# EAGLE design SC-STAGE (EAGLE 9.4.0)
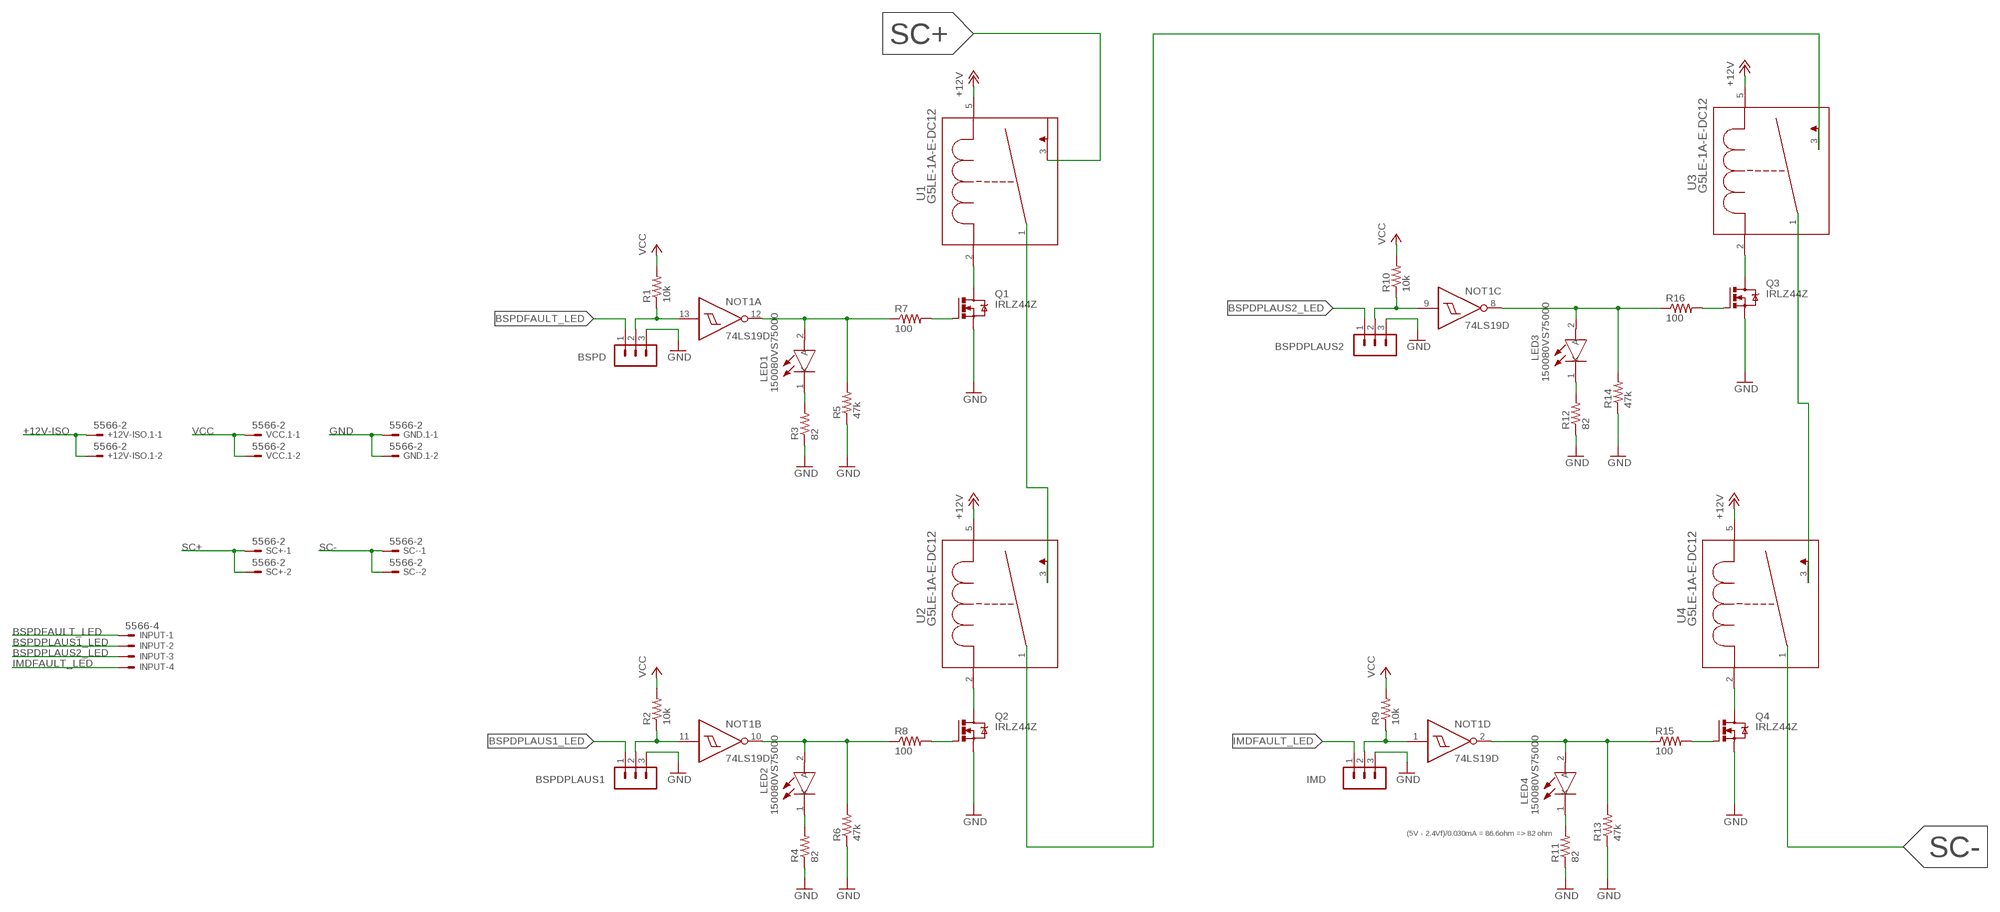
[diagram p0: schematic, sheet 1]

## Parts
+12V-ISO.1  5566-2  [5566-2]
BSPD  MA03-1  [MA03-1]
BSPDPLAUS1  MA03-1  [MA03-1]
BSPDPLAUS2  MA03-1  [MA03-1]
GND.1  5566-2  [5566-2]
IMD  MA03-1  [MA03-1]
INPUT  5566-4  [5566-4]
LED1  150080VS75000  [LEDC2012X80N]
LED2  150080VS75000  [LEDC2012X80N]
LED3  150080VS75000  [LEDC2012X80N]
LED4  150080VS75000  [LEDC2012X80N]
NOT1  74LS19D  [SO14]
Q1  IRLZ44Z  [TO220BH]
Q2  IRLZ44Z  [TO220BH]
Q3  IRLZ44Z  [TO220BH]
Q4  IRLZ44Z  [TO220BH]
R1  10k  R-US_R0805  [R0805]
R2  10k  R-US_R0805  [R0805]
R3  82  R-US_R0805  [R0805]
R4  82  R-US_R0805  [R0805]
R5  47k  R-US_R0805  [R0805]
R6  47k  R-US_R0805  [R0805]
R7  100  R-US_R0805  [R0805]
R8  100  R-US_R0805  [R0805]
R9  10k  R-US_R0805  [R0805]
R10  10k  R-US_R0805  [R0805]
R11  82  R-US_R0805  [R0805]
R12  82  R-US_R0805  [R0805]
R13  47k  R-US_R0805  [R0805]
R14  47k  R-US_R0805  [R0805]
R15  100  R-US_R0805  [R0805]
R16  100  R-US_R0805  [R0805]
SC+  5566-2  [5566-2]
SC-  5566-2  [5566-2]
U1  G5LE-1A-E-DC12  [G5LE-1A-E-DC12]
U2  G5LE-1A-E-DC12  [G5LE-1A-E-DC12]
U3  G5LE-1A-E-DC12  [G5LE-1A-E-DC12]
U4  G5LE-1A-E-DC12  [G5LE-1A-E-DC12]
VCC.1  5566-2  [5566-2]

## Nets
+12V-ISO: +12V-ISO.1.1 +12V-ISO.1.2 U1.5 U2.5 U3.5 U4.5 ; supply symbol labelled +12V
BSPDFAULT_LED: BSPD.1 INPUT.1
BSPDPLAUS1_LED: BSPDPLAUS1.1 INPUT.2
BSPDPLAUS2_LED: BSPDPLAUS2.1 INPUT.3
GND: BSPD.3 BSPDPLAUS1.3 BSPDPLAUS2.3 GND.1.1 GND.1.2 IMD.3 Q1.S Q2.S Q3.S Q4.S R3.1 R4.1 R5.1 R6.1 R11.1 R12.1 R13.1 R14.1
IMDFAULT_LED: IMD.1 INPUT.4
LED4: LED4.1(K) R11.2
N$1: Q1.G R7.2
N$2: LED1.2(A) NOT1.12(A:O) R5.2 R7.1
N$3: LED1.1(K) R3.2
N$4: Q1.D U1.2
N$5: Q2.G R8.2
N$6: LED2.2(A) NOT1.10(B:O) R6.2 R8.1
N$7: LED2.1(K) R4.2
N$8: Q2.D U2.2
N$9: U1.1 U2.3
N$10: U3.1 U4.3
N$14: Q4.G R15.2
N$15: LED4.2(A) NOT1.2(D:O) R13.2 R15.1
N$17: Q4.D U4.2
N$18: Q3.G R16.2
N$19: LED3.2(A) NOT1.8(C:O) R14.2 R16.1
N$20: LED3.1(K) R12.2
N$21: Q3.D U3.2
N$38: U2.1 U3.3
N$626: BSPDPLAUS2.2 NOT1.9(C:I) R10.1
N$9581: IMD.2 NOT1.1(D:I) R9.1
N$11552: BSPDPLAUS1.2 NOT1.11(B:I) R2.1
N$105105: BSPD.2 NOT1.13(A:I) R1.1
SC+: SC+.1 SC+.2 U1.3
SC-: SC-.1 SC-.2 U4.1
VCC: R1.2 R2.2 R9.2 R10.2 VCC.1.1 VCC.1.2
Unconnected: NOT1.3(E:I) NOT1.4(E:O) NOT1.5(F:I) NOT1.6(F:O)

## Notes on the sheet
- (5V - 2.4Vf)/0.030mA = 86.6ohm => 82 ohm

## Power pins joined to a net without a drawn wire
GND: NOT1.7(P:GND)
VCC: NOT1.14(P:VCC)

## Library data of the parts
+12V-ISO.1 GND.1 SC+ SC- VCC.1 = con-molex:5566-2: Mini FIT connector 2 pol Source: http://www.molex.com; MF: MOLEX; OC_FARNELL: 1822072; OC_NEWARK: unknown
BSPD BSPDPLAUS1 BSPDPLAUS2 IMD = con-lstb:MA03-1: PIN HEADER; OC_FARNELL: unknown; OC_NEWARK: unknown
INPUT = con-molex:5566-4: Mini FIT connector 4 pol Source: http://www.molex.com; MF: MOLEX; OC_FARNELL: unknown; OC_NEWARK: unknown
LED1-LED4 = 150080VS75000:150080VS75000: Wurth Elektronik WL-SMCW 570 nm Green LED, 2012 (0805) Clear SMD package Source: Datasheet <https://componentsearchengine.com/Datasheets/1/150080VS75000.pdf>; DESCRIPTION: Wurth Elektronik WL-SMCW 570 nm Green LED, 2012 (0805) Clear SMD package; HEIGHT: 0.8mm; MANUFACTURER_NAME: Wurth Elektronik; MANUFACTURER_PART_NUMBER: 150080VS75000; MOUSER_PART_NUMBER: 710-150080VS75000; MOUSER_PRICE-STOCK: https://www.mouser.com/Search/Refine.aspx?Keyword=710-150080VS75000
NOT1 = 74xx-us:74*19: Hex schmitt trigger INVERTER
Q1-Q4 = transistor-power:IRLZ44Z: N-Channel HEXFET® Power MOSFET Logic Level AUTOMOTIVE MOSFET Source: http://www.irf.com/product-info/datasheets/data/irlz44zpbf.pdf
R1-R16 = rcl:R-US_: RESISTOR, American symbol; SPICEPREFIX: R
U1-U4 = IowaFormula:G5LE-1A-E-DC12; MANUFACTURER_PART_NUMBER: G5LE1A4 DC5; VENDOR: OMRON

## Board
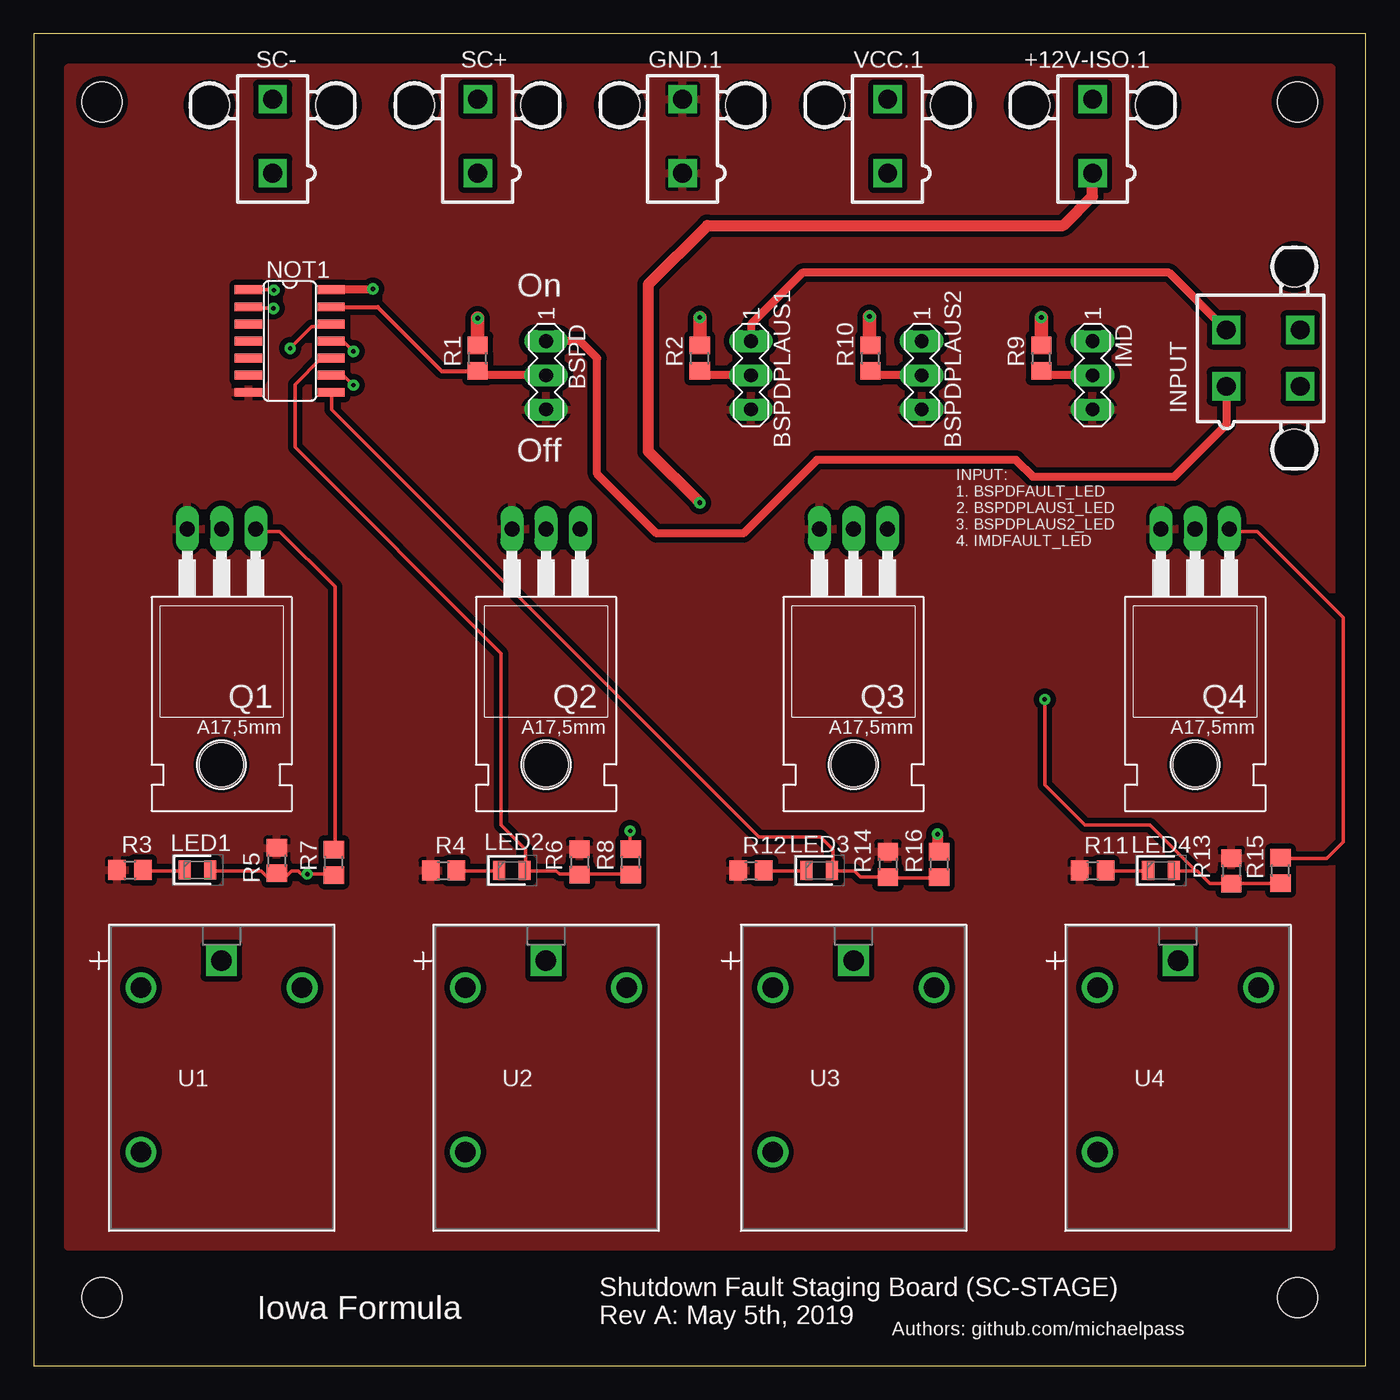
[diagram p1: board, top side]
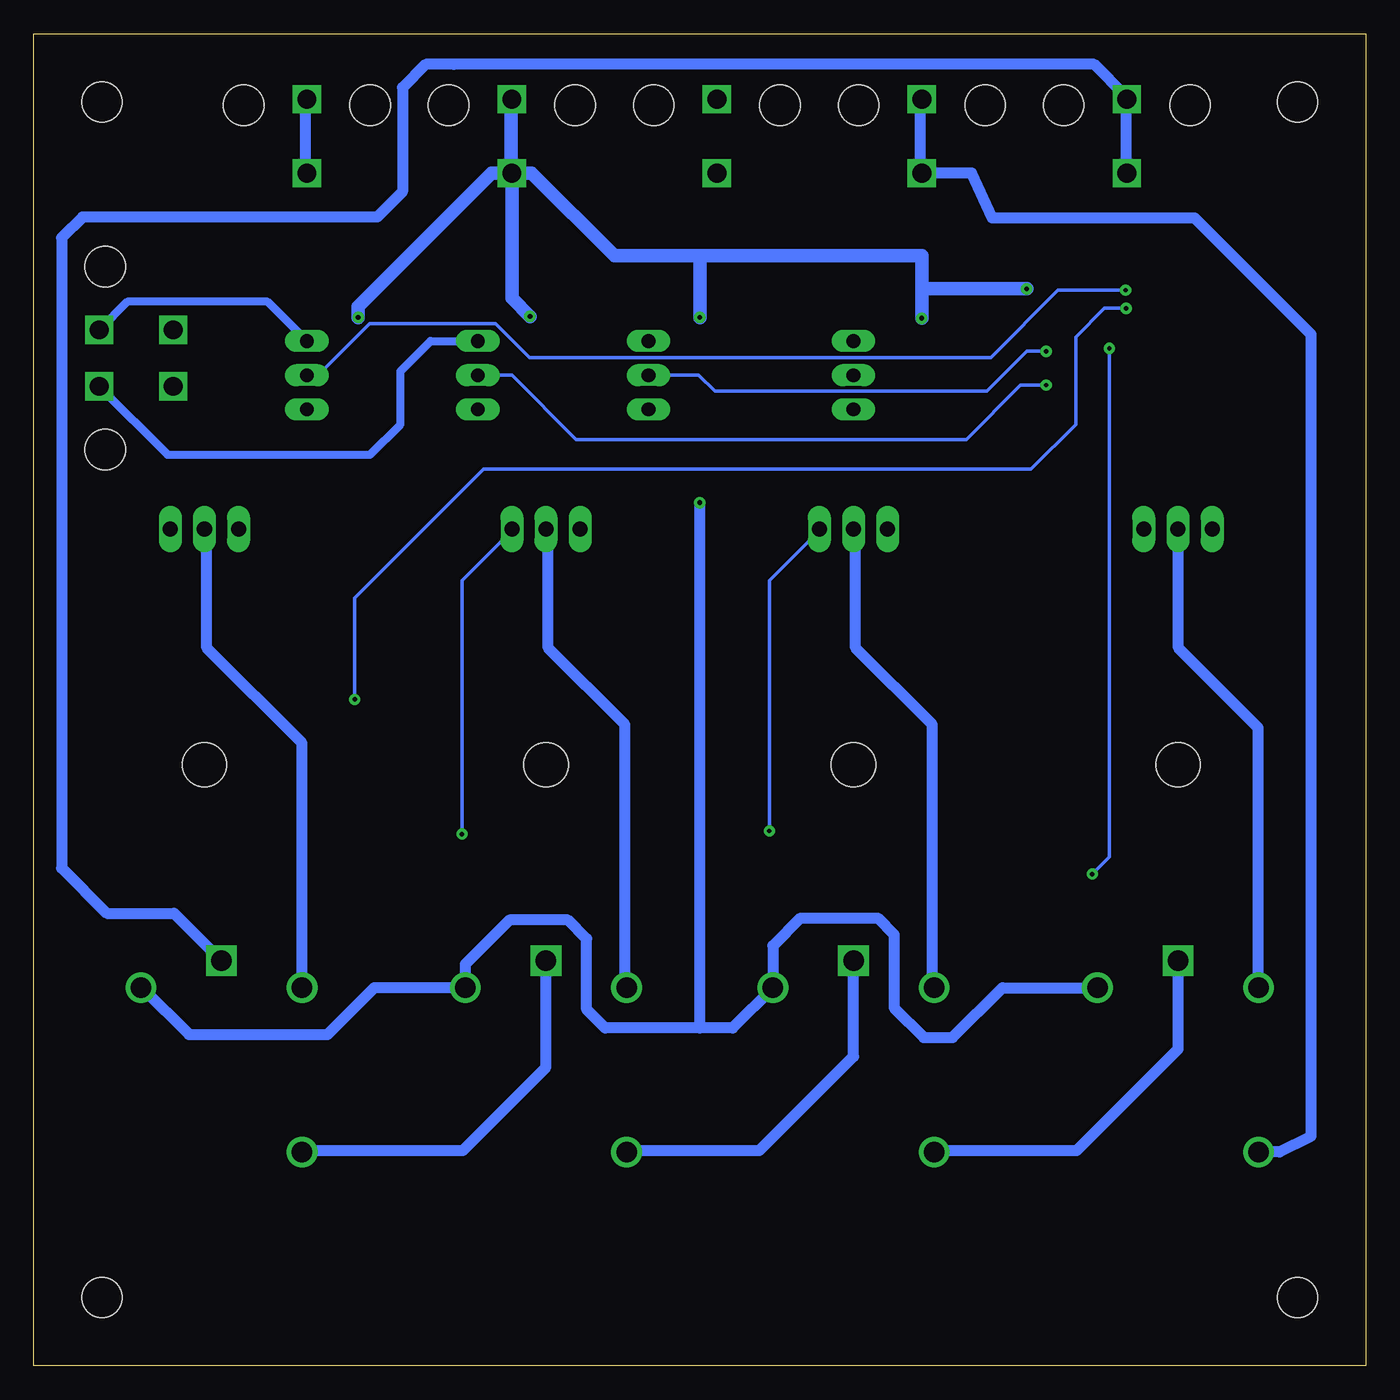
[diagram p2: board, bottom side, seen from below]

Size 99.06 x 99.06 mm. Coordinates in mm from the lower left corner, seen from the top.
Outline: 0,0 99.06,0 99.06,99.06 0,99.06 0,0
Copper layers (1*16): Top 0.035mm / dielectric 1.5mm / Bottom 0.035mm
Design rules "default *": minimum track width 10mil, minimum drill 13mil, track to track 8mil, track to pad 8mil, pad to pad 8mil, via to via 8mil, smd to smd 8mil, copper to edge 10mil, drill to drill 8mil, minimum pad ring 12mil, minimum via ring 10mil, stop-mask expansion 4mil, vias tented up to drill 25mil, thermal gap 10mil
Holes 3 mm at 93.98,93.98 5.08,93.98 5.08,5.08 93.98,5.08

### Footprints (pad centres in the part's own frame; a part is rotated, then mirrored left to right if it is on the bottom)
5566-2 = drill 1.4 square: 1 0,-2.75; 2 0,2.75 | hole 3: 4.7,2.29; -4.7,2.29
MA03-1 = drill 1.016 long: 1 -2.54,0; 2 0,0; 3 2.54,0
5566-4 = drill 1.4 square: 1 2.1,-2.75; 2 -2.1,-2.75; 3 2.1,2.75; 4 -2.1,2.75 | hole 3: 6.8,2.29; -6.8,2.29
LEDC2012X80N = smd 0.9 x 1.4: 1 -0.95,0; 2 0.95,0
SO14 = smd 0.66 x 2.032: 1 -3.81,-3.073; 2 -2.54,-3.073; 3 -1.27,-3.073; 4 0,-3.073; 5 1.27,-3.073; 6 2.54,-3.073; 7 3.81,-3.073; 8 3.81,3.073; 9 2.54,3.073; 10 1.27,3.073; 11 0,3.073; 12 -1.27,3.073; 13 -2.54,3.073; 14 -3.81,3.073
TO220BH = drill 1.118 long: D 0,-6.35; G -2.54,-6.35; S 2.54,-6.35 | hole 3.302: 0,11.176
R0805 = smd 1.3 x 1.5: 1 -0.95,0; 2 0.95,0
G5LE-1A-E-DC12 = drill 1.524 pad 2.032 square: 1 0,17.424 | drill 1.524 pad 2.032: 2 -5.994,15.418; 3 -5.994,3.2; 5 5.994,15.418

### Placement (x,y rotation side)
+12V-ISO.1  78.74,91.44 0 top
BSPD  38.1,73.66 270 top
BSPDPLAUS1  53.34,73.66 270 top
BSPDPLAUS2  66.04,73.66 270 top
GND.1  48.26,91.44 0 top
IMD  78.74,73.66 270 top
INPUT  91.44,74.93 270 top
LED1  12.19,36.88 0 top
LED2  35.56,36.83 0 top
LED3  58.42,36.83 0 top
LED4  83.82,36.83 0 top
NOT1  19.05,76.2 270 top
Q1  13.97,55.88 180 top
Q2  38.1,55.88 180 top
Q3  60.96,55.88 180 top
Q4  86.36,55.88 180 top
R1  33.02,74.93 90 top
R2  49.53,74.93 90 top
R3  7.16,36.88 0 top
R4  30.48,36.83 0 top
R5  18.08,37.57 270 top
R6  40.59,37.47 270 top
R7  22.33,37.44 90 top
R8  44.4,37.47 90 top
R9  74.93,74.93 90 top
R10  62.23,74.93 90 top
R11  78.74,36.83 0 top
R12  53.34,36.83 0 top
R13  89.05,36.8 270 top
R14  63.53,37.29 270 top
R15  92.71,36.83 90 top
R16  67.34,37.29 90 top
SC+  33.02,91.44 0 top
SC-  17.78,91.44 0 top
U1  13.97,12.7 0 top
U2  38.1,12.7 0 top
U3  60.96,12.7 0 top
U4  85.09,12.7 0 top
VCC.1  63.5,91.44 0 top

### Tracks (layer width: path | path; a pad name or v marks a point on that pad's centre or on a via)
+12V-ISO  (via drill 0.35)
  Top 0.813: v49.53,64.19 45.72,68 45.72,80.42 50.09,84.78 76.56,84.78 78.74,86.96 +12V-ISO.1.1
  Bottom 0.254: 78.87,88.7 +12V-ISO.1.1 | 78.87,94.18 +12V-ISO.1.2 | 90.98,28.12 U4.5
  Bottom 0.813: 78.87,94.18 78.87,88.7 | U1.5 27.03,28.12 30.73,24.41 32.87,24.41 35.08,26.62 35.08,32.08 36.3,33.3 42.04,33.3 44.09,31.24 U2.5 47.09,25.12 49.53,25.12 | 49.53,25.12 56.57,25.12 57.94,26.49 57.94,31.75 59.33,33.15 63.68,33.15 66.95,29.87 U3.5 73.74,28.12 77.22,24.64 87.5,24.64 90.98,28.12 | 49.53,25.12 v49.53,64.19
BSPDFAULT_LED
  Top 0.61: INPUT.1 88.69,72.39 88.69,70 84.8,66.12 74.3,66.12 73.05,67.36 58.24,67.36 52.78,61.9 46.33,61.9 41.91,66.32 41.91,74.93 40.64,76.2 BSPD.1
BSPDPLAUS1_LED
  Top 0.61: INPUT.2 84.44,81.28 57.15,81.28 53.34,77.47 BSPDPLAUS1.1
BSPDPLAUS2_LED
  Bottom 0.61: INPUT.3 89.1,67.74 74.04,67.74 71.78,70 71.78,73.97 69.55,76.2 BSPDPLAUS2.1
GND
  pour Top (isolate 0.406): 3.81,8.89 96.52,8.89 96.52,96.52 2.54,96.52 2.54,8.89
IMDFAULT_LED
  Bottom 0.61: IMD.1 81.66,79.12 92.1,79.12 INPUT.4
LED4
  Top 0.254: LED4.1 82.75,36.8 79.78,36.8 R11.2
N$1
  Top 0.254: R7.2 22.4,38.41 22.4,57.94 18.29,62.05 16.69,62.05 Q1.G
N$2  (via drill 0.33)
  Top 0.254: LED1.2 13.26,36.8 16.92,36.8 17.37,36.35 17.83,36.35 18.06,36.58 R5.2 18.29,36.58 18.52,36.35 18.75,36.35 19.2,36.8 19.66,36.8 19.89,36.58 v20.34,36.58 22.17,36.58 R7.1 | v19.07,75.67 20.68,77.27 21.95,77.27 NOT1.12
  Bottom 0.254: v19.07,75.67 19.07,37.85 v20.34,36.58
N$3
  Top 0.254: LED1.1 11.2,36.8 8.23,36.8 R3.2
N$4
  Bottom 0.254: 13.95,62.05 Q1.D | 8,28.12 U1.2
  Bottom 0.813: 13.95,62.05 13.95,53.39 8,47.45 8,28.12
N$5  (via drill 0.33)
  Top 0.254: v44.35,39.78 44.35,38.63 R8.2
  Bottom 0.254: v44.35,39.78 44.35,58.4 40.69,62.05 Q2.G
N$6
  Top 0.254: R8.1 44.35,36.58 40.69,36.58 R6.2 40.46,36.58 39.09,36.58 38.86,36.8 36.58,36.8 LED2.2 36.58,37.03 36.58,38.41 34.75,40.23 34.75,52.98 19.43,68.3 19.43,72.97 21.39,74.93 NOT1.10
N$7
  Top 0.254: LED2.1 34.52,36.8 31.55,36.8 R4.2
N$8
  Bottom 0.254: 37.95,62.05 Q2.D | 32.23,28.12 U2.2
  Bottom 0.813: 37.95,62.05 37.95,53.39 32.23,47.68 32.23,28.12
N$9
  Bottom 0.254: 32,16 U2.3
  Bottom 0.813: 32,16 21.51,16 13.97,23.55 U1.1
N$10
  Bottom 0.254: 79.1,16 U4.3
  Bottom 0.813: 79.1,16 67.16,16 60.96,22.2 U3.1
N$14
  Top 0.254: R15.2 92.81,37.72 96.14,37.72 97.38,38.96 97.38,55.65 90.98,62.05 88.92,62.05 Q4.G
N$15  (via drill 0.33)
  Top 0.254: 86.41,36.8 86.54,36.8 87.45,35.89 88.92,35.89 R13.2 89.15,35.89 92.58,35.89 R15.1 | 86.41,36.8 84.81,36.8 LED4.2 | v17.83,78.64 16,78.64 NOT1.2 | 86.41,36.8 82.98,40.23 78.16,40.23 75.18,43.2 v75.18,49.55
  Bottom 0.254: v17.83,78.64 19.43,78.64 21.57,76.5 21.57,70 24.89,66.67 65.61,66.67 75.18,57.1 v75.18,49.55
N$17
  Bottom 0.254: 86.18,62.05 Q4.D
  Bottom 0.813: 86.18,62.05 86.18,53.39 79.1,46.3 U4.2
N$18  (via drill 0.33)
  Top 0.254: 67.21,38.41 R16.2
  Top 0.813: v67.21,39.55 67.21,38.41
  Bottom 0.254: v67.21,39.55 67.21,58.4 63.55,62.05 Q3.G
N$19
  Top 0.254: R16.1 67.27,36.27 63.65,36.27 63.56,36.36 63.55,36.35 R14.2 63.32,36.35 61.49,36.35 61.04,36.8 59.44,36.8 LED3.2 59.44,37.03 59.44,38.41 58.52,39.32 53.95,39.32 22.17,71.09 22.17,72.24 NOT1.8
N$20
  Top 0.254: LED3.1 57.38,36.8 54.41,36.8 R12.2
N$21
  Bottom 0.254: 60.81,62.05 Q3.D | 55.09,28.12 U3.2
  Bottom 0.813: 60.81,62.05 60.81,53.39 55.09,47.68 55.09,28.12
N$38
  Bottom 0.254: 54.86,16 U3.3
  Bottom 0.813: 54.86,16 45.11,16 38.1,23.01 U2.1
N$626  (via drill 0.33)
  Top 0.254: v23.77,72.92 23.09,73.61 22.17,73.61 NOT1.9
  Top 0.61: BSPDPLAUS2.2 62.55,73.66 R10.1
  Bottom 0.254: v23.77,72.92 25.68,72.92 29.72,68.89 58.73,68.89 63.5,73.66 BSPDPLAUS2.2
N$9581  (via drill 0.33)
  Top 0.254: NOT1.1 17.83,80.01 v17.86,79.98
  Top 0.61: IMD.2 75.25,73.66 R9.1
  Bottom 0.254: v17.86,79.98 22.89,79.98 27.89,74.98 62.18,74.98 64.69,77.5 74.07,77.5 77.72,73.84 78.64,73.84 IMD.2
N$11552  (via drill 0.33)
  Top 0.254: v23.77,75.44 23.09,76.12 22.17,76.12 NOT1.11
  Top 0.61: BSPDPLAUS1.2 49.85,73.66 R2.1
  Bottom 0.254: v23.77,75.44 25.2,75.44 28.17,72.47 48.41,72.47 49.61,73.66 BSPDPLAUS1.2
N$105105
  Top 0.305: NOT1.13 25.58,78.74 30.35,73.97 33.01,73.97 R1.1
  Top 0.61: BSPD.2 33.34,73.66 R1.1
SC+
  Bottom 0.254: 33.15,88.7 SC+.1 | 33.15,94.18 SC+.2
  Bottom 0.813: 33.15,94.18 33.15,88.7 | U1.3 6.43,15.9 4.09,17.07 4.09,76.71 12.75,85.37 27.8,85.37 29.32,88.69 SC+.1
SC-
  Bottom 0.254: 17.83,88.7 SC-.1 | 17.83,94.18 SC-.2 17.83,94.41
  Bottom 0.813: 17.83,94.18 17.83,88.7 | U4.1 88.62,33.66 93.62,33.66 96.98,37.01 96.98,83.87 95.43,85.42 79.17,85.42 73.51,85.42 71.63,87.3 71.63,95.05 69.9,96.77 67.82,96.77 20.19,96.77 17.83,94.41
VCC  (via drill 0.35)
  Top 0.61: v25.22,80.09 25.17,80.03 22.15,80.03 NOT1.14
  Top 1.016: v74.93,77.95 R9.2 | v33.02,77.9 R1.2 | v49.53,77.95 R2.2 | v62.15,78.03 62.15,75.96 R10.2
  Bottom 0.254: 63.55,94.18 VCC.1.2 | 63.55,89.15 VCC.1.1
  Bottom 1.016: VCC.1.1 62.02,88.69 55.88,82.55 49.53,82.55 | 49.53,82.55 33.02,82.55 33.02,80.09 | VCC.1.1 65,88.69 74.93,78.76 v74.93,77.95 | 33.02,80.09 v33.02,77.9 | 49.53,82.55 v49.53,77.95 | VCC.1.1 63.5,79.38 v62.15,78.03 | 33.02,80.09 v25.22,80.09 | 63.55,89.15 63.55,94.18

### Text on the board
tPlace: INPUT: / 1. BSPDFAULT_LED / 2. BSPDPLAUS1_LED / 3. BSPDPLAUS2_LED / 4. IMDFAULT_LED
tNames: On | Off | Iowa Formula | Shutdown Fault Staging Board (SC-STAGE) / Rev A: May 5th, 2019 | Authors: github.com/michaelpass